# Altium schematic sheet Sheet1.SchDoc
size A1; Organization: Altium Limited; Address1: L3, 12a Rodborough Rd; Address2: Frenchs Forest; Address3: NSW; Address4: Australia 2086
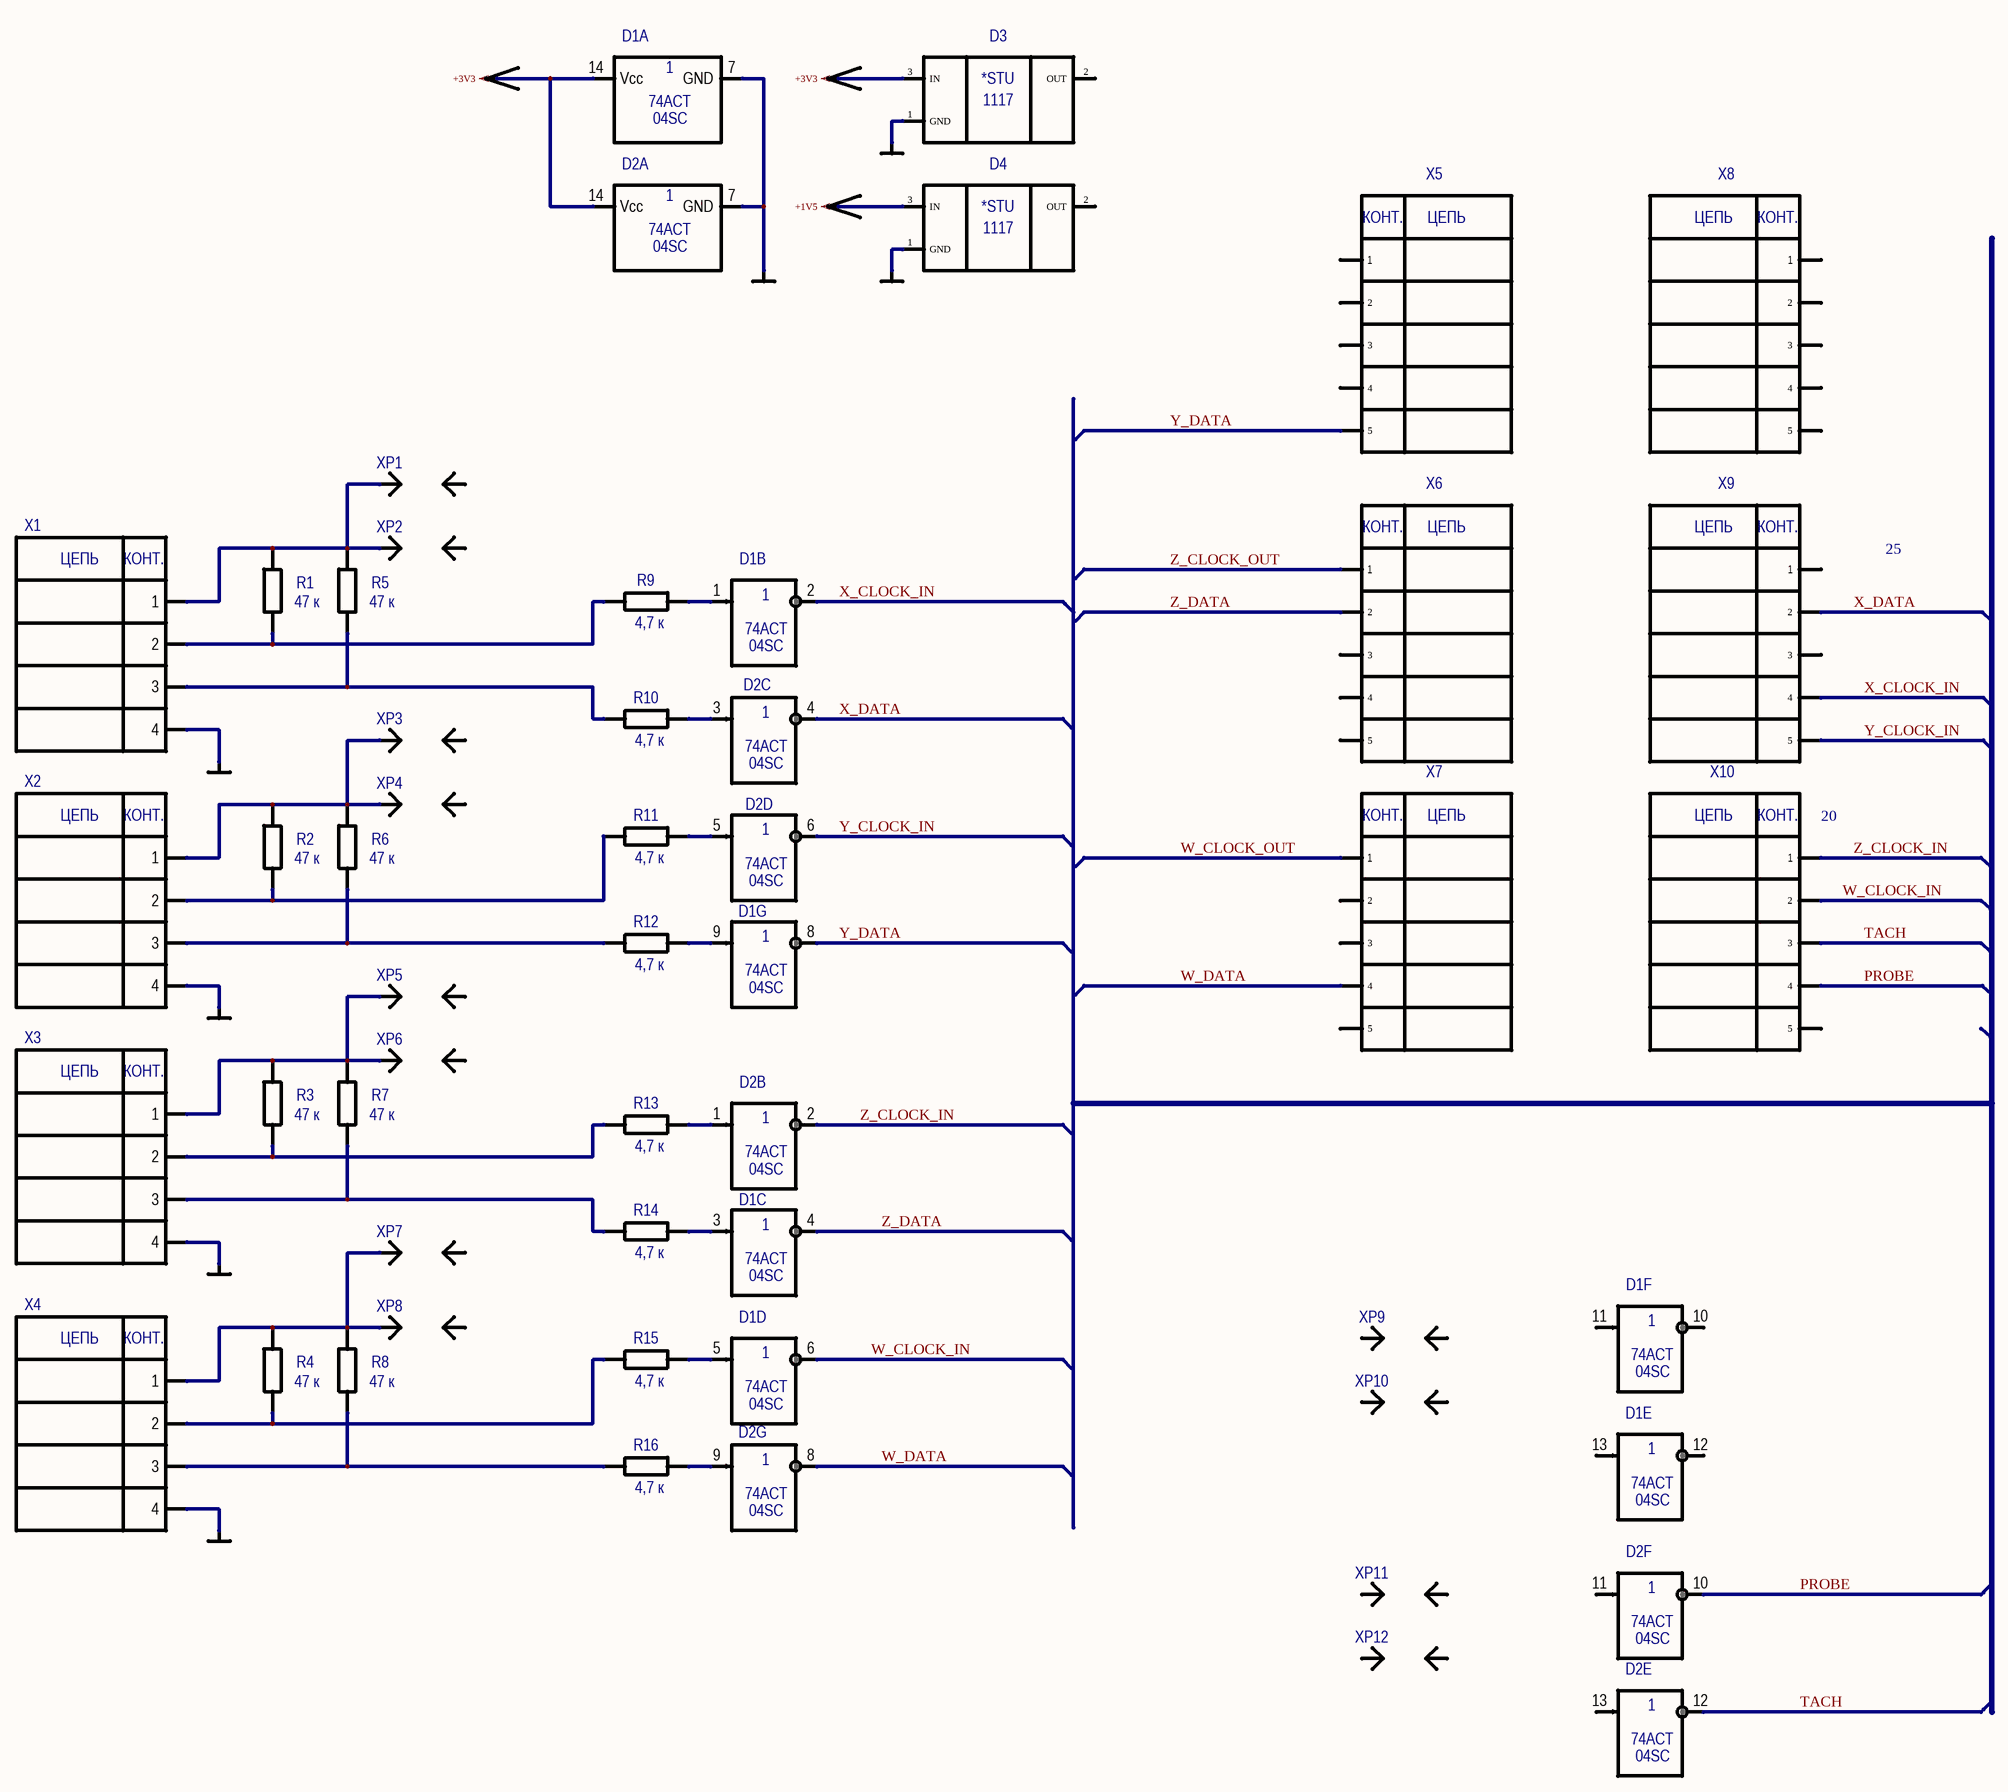
[diagram p0: Sheet1.SchDoc]

## Parts
(Parts that share a designator on the sheet are numbered #1, #2 ... from top to bottom, then left to right.)
*#1  VCC  (value not drawn)  (graphical)
*#2  GND  (value not drawn)  (graphical)
*?#1  VCC  (value not drawn)  (graphical)
*?#2  GND  (value not drawn)  (graphical)
*?#3  VCC  (value not drawn)  (graphical)
*?#4  GND  (value not drawn)  (graphical)
*?#5  GND  (value not drawn)  (graphical)
*?#6  GND  (value not drawn)  (graphical)
*?#7  GND  (value not drawn)  (graphical)
*?#8  GND  (value not drawn)  (graphical)
D1  74ACT04SC  [SOIC127P600X175-14N]  (value not drawn)  (parts A,B,C,D,E,F,G of 7)
D2  74ACT04SC  [SOIC127P600X175-14N]  (value not drawn)  (parts A,B,C,D,E,F,G of 7)
D3  NCP1117ST33T3  [SOT230P700X180-4N]  (value not drawn)
D4  NCP1117ST20T3G  [SOT230P700X180-4N]  (value not drawn)
R1  47 к  [RESC1608L]
R2  47 к  [RESC1608L]
R3  47 к  [RESC1608L]
R4  47 к  [RESC1608L]
R5  47 к  [RESC1608L]
R6  47 к  [RESC1608L]
R7  47 к  [RESC1608L]
R8  47 к  [RESC1608L]
R9  4,7 к  [RESC1608L]
R10  4,7 к  [RESC1608L]
R11  4,7 к  [RESC1608L]
R12  4,7 к  [RESC1608L]
R13  4,7 к  [RESC1608L]
R14  4,7 к  [RESC1608L]
R15  4,7 к  [RESC1608L]
R16  4,7 к  [RESC1608L]
X1  PLS-4  [PLS-4]  (value not drawn)
X2  PLS-4  [PLS-4]  (value not drawn)
X3  PLS-4  [PLS-4]  (value not drawn)
X4  PLS-4  [PLS-4]  (value not drawn)
X5  PLS-5  [PLS-5]  (value not drawn)
X6  PLS-5  [PLS-5]  (value not drawn)
X7  PLS-5  [PLS-5]  (value not drawn)
X8  PLS-5  [PLS-5]  (value not drawn)
X9  PLS-5  [PLS-5]  (value not drawn)
X10  PLS-5  [PLS-5]  (value not drawn)
XP1  PLD2-2  [PLD2-2]  (value not drawn)
XP2  PLD2-2  [PLD2-2]  (value not drawn)
XP3  PLD2-2  [PLD2-2]  (value not drawn)
XP4  PLD2-2  [PLD2-2]  (value not drawn)
XP5  PLD2-2  [PLD2-2]  (value not drawn)
XP6  PLD2-2  [PLD2-2]  (value not drawn)
XP7  PLD2-2  [PLD2-2]  (value not drawn)
XP8  PLD2-2  [PLD2-2]  (value not drawn)
XP9  PLD2-2  [PLD2-2]  (value not drawn)
XP10  PLD2-2  [PLD2-2]  (value not drawn)
XP11  PLD2-2  [PLD2-2]  (value not drawn)
XP12  PLD2-2  [PLD2-2]  (value not drawn)

## Nets
+1V5: D4.3(IN)
+3V3: D1.14(Vcc) D2.14(Vcc) D3.3(IN)
GND: D1.7(GND) D2.7(GND) D3.1(GND) D4.1(GND) X4.4
PROBE: D2.10(O4) X10.4
TACH: D2.12(O3) X10.3
W_CLOCK_IN: D1.6(O2) X10.2
W_CLOCK_OUT: X7.1
W_DATA: D2.8(O5) X7.4
X_CLOCK_IN: D1.2(Oo) X9.4
X_DATA: D2.4(O1) X9.2
Y_CLOCK_IN: D2.6(O2) X9.5
Y_DATA: D1.8(O5) X5.5
Z_CLOCK_IN: D2.2(Oo) X10.1
Z_CLOCK_OUT: X6.1
Z_DATA: D1.4(O1) X6.2
NetD1_1: D1.1(Ao) R9.2
NetD1_3: D1.3(A1) R14.2
NetD1_5: D1.5(A2) R15.2
NetD1_9: D1.9(A5) R12.2
NetD2_1: D2.1(Ao) R13.2
NetD2_3: D2.3(A1) R10.2
NetD2_5: D2.5(A2) R11.2
NetD2_9: D2.9(A5) R16.2
NetR1_1: R1.1 R9.1 X1.2
NetR1_2: R1.2 R5.2 X1.1 XP1.1 XP2.1
NetR2_1: R2.1 R11.1 X2.2
NetR2_2: R2.2 R6.2 X2.1 XP3.1 XP4.1
NetR3_1: R3.1 R13.1 X3.2
NetR3_2: R3.2 R7.2 X3.1 XP5.1 XP6.1
NetR4_1: R4.1 R15.1 X4.2
NetR4_2: R4.2 R8.2 X4.1 XP7.1 XP8.1
NetR5_1: R5.1 R10.1 X1.3
NetR6_1: R6.1 R12.1 X2.3
NetR7_1: R7.1 R14.1 X3.3
NetR8_1: R8.1 R16.1 X4.3

Not connected (* = marked no-connect by the designer): D1 10(O4) 11(A4) 12(O3) 13(A3); D2 11(A4) 13(A3); D3 2(OUT); D4 2(OUT); X1 4; X2 4; X3 4; X5 1 2 3 4; X6 3 4 5; X7 2 3 5; X8 1 2 3 4 5; X9 1 3; X10 5; XP1 2; XP2 2; XP3 2; XP4 2; XP5 2; XP6 2; XP7 2; XP8 2; XP9 1 2; XP10 1 2; XP11 1 2; XP12 1 2

## Notes on the sheet
- 25
- (near X10) 20
- Title
- Size:
- Date:
- File:
- A1
- Number:
- Time:
- Revision:
- Sheet
- of
- (in symbol 74ACT04SC, part A) 74ACT; 04SC
- (in symbol 74ACT04SC, part B) 74ACT; 04SC
- (in symbol 74ACT04SC, part C) 74ACT; 04SC
- (in symbol 74ACT04SC, part D) 74ACT; 04SC
- (in symbol 74ACT04SC, part E) 74ACT; 04SC
- (in symbol 74ACT04SC, part F) 74ACT; 04SC
- (in symbol 74ACT04SC, part G) 74ACT; 04SC
- (in symbol NCP1117ST20T3G) *STU; 1117
- (in symbol NCP1117ST33T3) *STU; 1117
- (in symbol PLS-4) ЦЕПЬ; КОНТ.
- (in symbol PLS-5) КОНТ.; ЦЕПЬ

## Library data of the parts
*#1 *?#1 *?#3 = VCC: Порт ЕСКД. Для "наложения" на штатный Power Bar
*#2 *?#2 *?#4-*?#8 = GND: Корпус ЕСКД. Для "наложения" на штатный Power Bar
D1 D2 = 74ACT04SC: Hex Inverter; Manufacturer: Fairchild Semiconductor; Type: Микросхема; SymAuthor: Календарова В.; BCPId: *; Name: *; Package: M14A; ManufacturerPartNumber: 74ACT04SC
D3 = NCP1117ST33T3: 1.0 A Low-Dropout Positive Fixed and Adjustable Voltage Regulators; Manufacturer: On Semiconductor; Type: Микросхема; BCPId: *; Name: *; Package: SOT-223; ManufacturerPartNumber: NCP1117ST33T3
D4 = NCP1117ST20T3G: 1.0 A Low-Dropout Positive Fixed and Adjustable Voltage Regulators; Manufacturer: On Semiconductor; Type: Микросхема; BCPId: *; Name: *; Package: SOT-223; ManufacturerPartNumber: NCP1117ST20T3G
R1-R16 = R0603: Чип-резистор; Name: 0603; Tolerance: {Tolerance}; Value: {Value}; BCPId: *; Manufacturer: *; ManufacturerPartNumber: *; Type: Резистор
X1-X4 = PLS-4: Штыри на плату, шаг 2.54мм., однорядные; ManufacturerPartNumber: PLS-4; Type: Вилка
X5-X10 = PLS-5: Штыри на плату, шаг 2.54мм., однорядные; BCPId: *; ManufacturerPartNumber: PLS-5; Rem: *; Package: *; TU/GOST: *; Type: Вилка; HelpURL: *; Price: *
XP1-XP12 = PLD2-2: Штыри на плату, шаг 2.00мм., двухрядные; BCPId: *; ManufacturerPartNumber: PLD2-2; Rem: *; Package: *; TU/GOST: *; Type: Вилка; HelpURL: *; Price: *